# Altium project SSB-Demod.PrjPcb
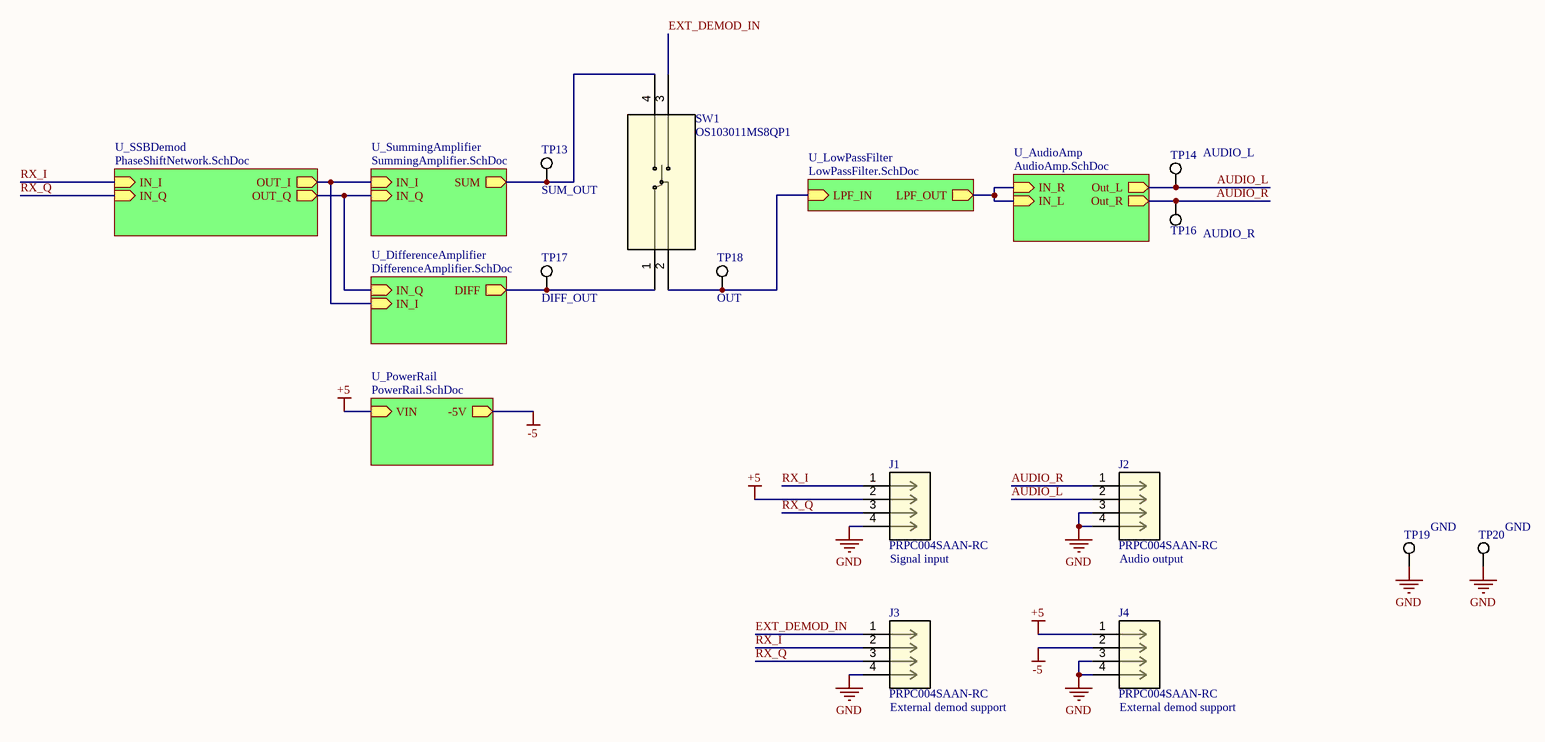
[diagram p0: TopLevel.SchDoc]
7 sheets, 135 parts. Net scope: hierarchical (ports join the sheet entries above them; power ports are global).
Board file: SSB-Demod.PcbDoc
Sheets:
  TopLevel.SchDoc
    U_SSBDemod = PhaseShiftNetwork.SchDoc
    U_AudioAmp = AudioAmp.SchDoc
    U_PowerRail = PowerRail.SchDoc
    U_SummingAmplifier = SummingAmplifier.SchDoc
    U_DifferenceAmplifier = DifferenceAmplifier.SchDoc
    U_LowPassFilter = LowPassFilter.SchDoc

## Sheet TopLevel.SchDoc
size 420 x 297 mm; SheetNumber: 1; SheetTotal: 7

### Parts
J1  PRPC004SAAN-RC  [CONN4_PRPC004_SUL]
J2  PRPC004SAAN-RC  [CONN4_PRPC004_SUL]
J3  PRPC004SAAN-RC  [CONN4_PRPC004_SUL]
J4  PRPC004SAAN-RC  [CONN4_PRPC004_SUL]
SW1  OS103011MS8QP1  [DIP4_SP3T-TOP_4P3X8P6_CNK]
TP13  SUM_OUT  [KSTN-5019_V]
TP14  AUDIO_L  [KSTN-5019_V]
TP16  AUDIO_R  [KSTN-5019_V]
TP17  DIFF_OUT  [KSTN-5019_V]
TP18  OUT  [KSTN-5019_V]
TP19  GND  [KSTN-5019_V]
TP20  GND  [KSTN-5019_V]

### Sub-sheets
U_AudioAmp = AudioAmp.SchDoc: IN_R (in), IN_L (in), Out_L (out), Out_R (out)
U_DifferenceAmplifier = DifferenceAmplifier.SchDoc: DIFF (out), IN_Q (in), IN_I (in)
U_LowPassFilter = LowPassFilter.SchDoc: LPF_IN (in), LPF_OUT (out)
U_PowerRail = PowerRail.SchDoc: -5V (out), VIN (in)
U_SSBDemod = PhaseShiftNetwork.SchDoc: IN_I (in), IN_Q (in), OUT_I (out), OUT_Q (out)
U_SummingAmplifier = SummingAmplifier.SchDoc: IN_I (in), IN_Q (in), SUM (out)

### Nets
+5: J1.2 J4.1 ; sheet U_PowerRail/VIN
-5: J4.2 ; sheet U_PowerRail/-5V
GND: J1.4 J2.3 J2.4 J3.4 J4.3 J4.4 TP19.1 TP20.1
AUDIO_L: J2.2 TP14.1 ; sheet U_AudioAmp/Out_L
AUDIO_R: J2.1 TP16.1 ; sheet U_AudioAmp/Out_R
EXT_DEMOD_IN: J3.1 SW1.3
RX_I: J1.1 J3.2 ; sheet U_SSBDemod/IN_I
RX_Q: J1.3 J3.3 ; sheet U_SSBDemod/IN_Q
NetC14_1: sheet U_AudioAmp/IN_R, sheet U_AudioAmp/IN_L, sheet U_LowPassFilter/LPF_OUT
NetR12_2: sheet U_SSBDemod/OUT_I, sheet U_SummingAmplifier/IN_I, sheet U_DifferenceAmplifier/IN_I
NetR30_2: sheet U_SSBDemod/OUT_Q, sheet U_SummingAmplifier/IN_Q, sheet U_DifferenceAmplifier/IN_Q
NetR44_2: SW1.4 TP13.1 ; sheet U_SummingAmplifier/SUM
NetR48_2: SW1.1 TP17.1 ; sheet U_DifferenceAmplifier/DIFF
NetSW1_2: SW1.2 TP18.1 ; sheet U_LowPassFilter/LPF_IN

### Notes on the sheet
- (near J1) Signal input
- (near J2) Audio output
- (near J3) External demod support
- (near J4) External demod support
- THIS DOCUMENT AND THE DATA DISCLOSED HEREIN OR
- HEREWITH IS THE PROPERTY OF ALTIUM LIMITED AND MAY
- DWG NO:
- REVISION
- REV:
- DESCRIPTION
- DATE
- APPROVED
- BE FREELY DISTRIBUTED IN WHOLE. NO RIGHTS ARE
- RESERVED OR EXPRESS OR IMPLIED WARANTEE GIVEN.
- ENG:
- APPROVALS
- PROJECT
- DSN:
- CHK:
- REFERENCE DOCUMENTS
- PROJECT REVISION:
- TITLE
- DOCUMENT REVISION:
- DESIGN ITEM:
- BOM:
- FAB DWG:
- PCB DWG:
- ASSY DWG:
- SCALE:
- A3
- SIZE
- CAGE CODE
- FILE NAME
- DWG NO.
- SHEET
- OF
- REV

### Library data of the parts
J1-J4 = PRPC004SAAN-RC: No Description Available; Mfr_Name: Sullins; Type: Headers, Male Pins; RefDes: RefDes
SW1 = OS103011MS8QP1: No Description Available; Mfr_Name: C&K Components; Type: Slide Switches; RefDes: RefDes
TP13 TP14 TP16-TP20 = CMP-1672-00008-1: Test Point, 1 Position SMD, RoHS, Tape and Reel; ComponentLink1Description: Manufacturer URL; Package Quantity: 1000; DatasheetVersion: 03/2014; Packaging: Tape and Reel; ComponentLink2URL: http://www.keyelco.com/product-pdf.cfm?p=1357; ComponentLink1URL: http://www.keyelco.com/; Mount: Surface Mount; Contact Plating: Silver; PackageDescription: 1-Pin Surface Mount Device, Body 3.81 x 2.03 mm; Pins: 1; RoHSCompliant: True; Mounting Technology: Surface Mount; ComponentLink2Description: Datasheet; PackageReference: 5019

## Sheet PhaseShiftNetwork.SchDoc: Phase Shifter
size 594 x 420 mm; SheetNumber: 4; SheetTotal: 7
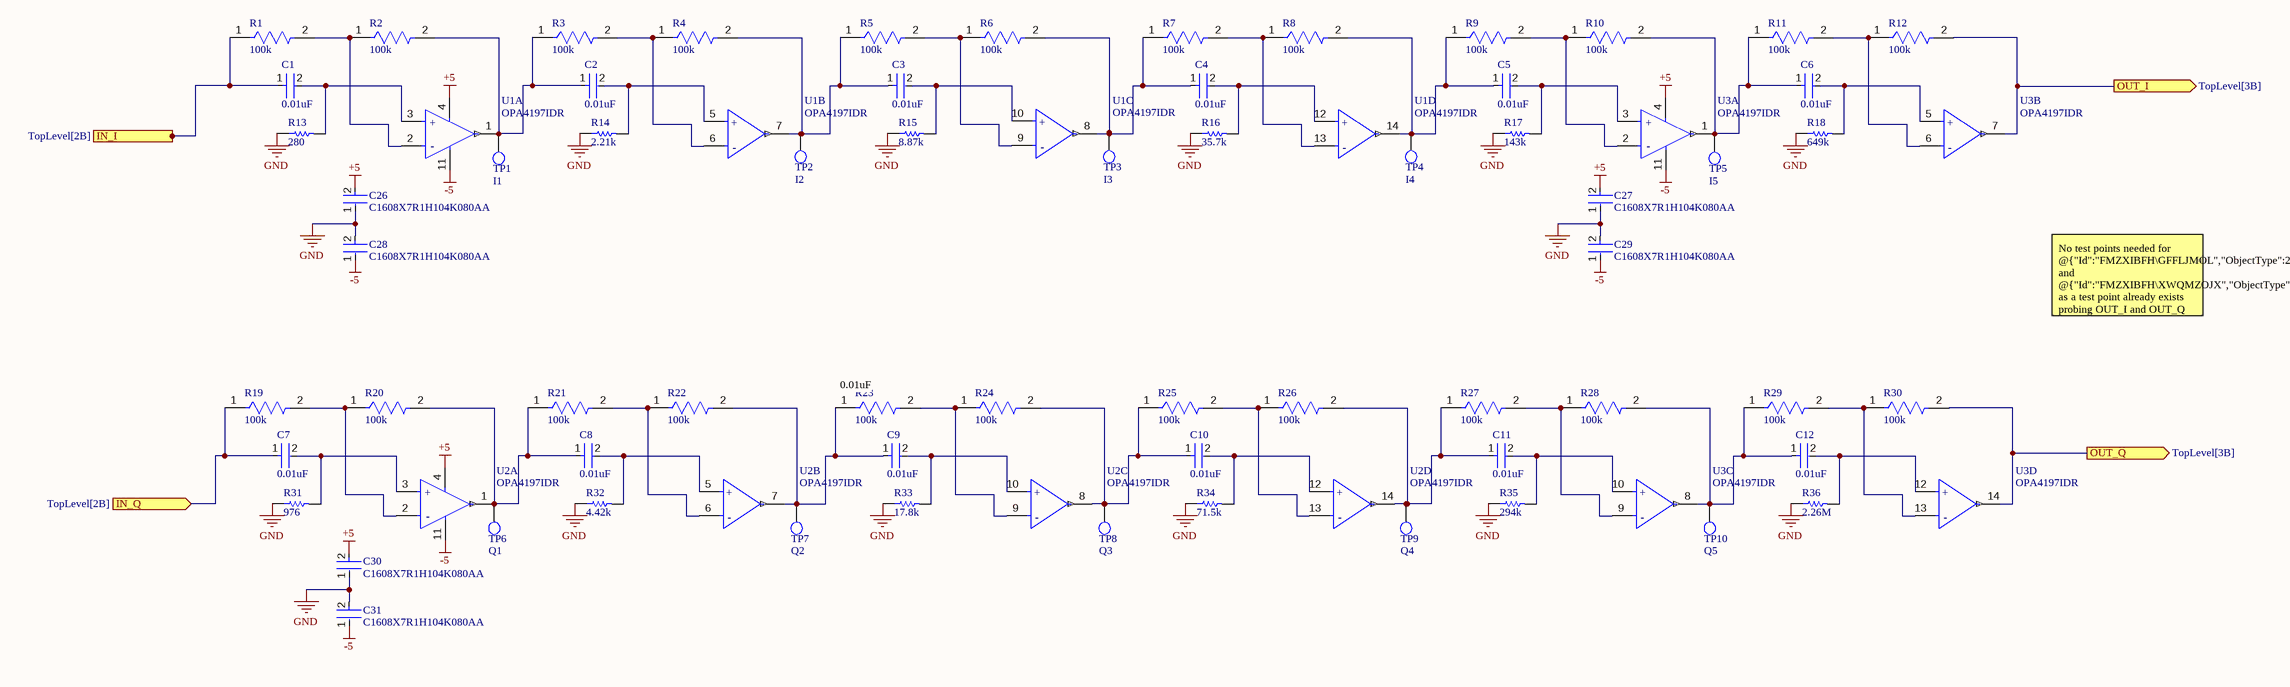
[diagram p1: PhaseShiftNetwork.SchDoc]

### Parts
C1  0.01uF  [FP-C0603C-CF-MFG]
C2  0.01uF  [FP-C0603C-CF-MFG]
C3  0.01uF  [FP-C0603C-CF-MFG]
C4  0.01uF  [FP-C0603C-CF-MFG]
C5  0.01uF  [FP-C0603C-CF-MFG]
C6  0.01uF  [FP-C0603C-CF-MFG]
C7  0.01uF  [FP-C0603C-CF-MFG]
C8  0.01uF  [FP-C0603C-CF-MFG]
C9  0.01uF  [FP-C0603C-CF-MFG]
C10  0.01uF  [FP-C0603C-CF-MFG]
C11  0.01uF  [FP-C0603C-CF-MFG]
C12  0.01uF  [FP-C0603C-CF-MFG]
C26  C1608X7R1H104K080AA  [FP-C1608-080-0_1-MFG]
C27  C1608X7R1H104K080AA  [FP-C1608-080-0_1-MFG]
C28  C1608X7R1H104K080AA  [FP-C1608-080-0_1-MFG]
C29  C1608X7R1H104K080AA  [FP-C1608-080-0_1-MFG]
C30  C1608X7R1H104K080AA  [FP-C1608-080-0_1-MFG]
C31  C1608X7R1H104K080AA  [FP-C1608-080-0_1-MFG]
R1  100k  [FP-RC0805-0_6-IPC_C]
R2  100k  [FP-RC0805-0_6-IPC_C]
R3  100k  [FP-RC0805-0_6-IPC_C]
R4  100k  [FP-RC0805-0_6-IPC_C]
R5  100k  [FP-RC0805-0_6-IPC_C]
R6  100k  [FP-RC0805-0_6-IPC_C]
R7  100k  [FP-RC0805-0_6-IPC_C]
R8  100k  [FP-RC0805-0_6-IPC_C]
R9  100k  [FP-RC0805-0_6-IPC_C]
R10  100k  [FP-RC0805-0_6-IPC_C]
R11  100k  [FP-RC0805-0_6-IPC_C]
R12  100k  [FP-RC0805-0_6-IPC_C]
R13  280  [RESC2013X60X35ML10T20]
R14  2.21k  [RESC2013X60X35ML10T20]
R15  8.87k  [RESC2013X60X35ML10T20]
R16  35.7k  [RESC2013X60X35ML10T20]
R17  143k  [RESC2013X60X35ML10T20]
R18  649k  [RESC2013X60X35ML10T20]
R19  100k  [FP-RC0805-0_6-IPC_C]
R20  100k  [FP-RC0805-0_6-IPC_C]
R21  100k  [FP-RC0805-0_6-IPC_C]
R22  100k  [FP-RC0805-0_6-IPC_C]
R23  100k  [FP-RC0805-0_6-IPC_C]
R24  100k  [FP-RC0805-0_6-IPC_C]
R25  100k  [FP-RC0805-0_6-IPC_C]
R26  100k  [FP-RC0805-0_6-IPC_C]
R27  100k  [FP-RC0805-0_6-IPC_C]
R28  100k  [FP-RC0805-0_6-IPC_C]
R29  100k  [FP-RC0805-0_6-IPC_C]
R30  100k  [FP-RC0805-0_6-IPC_C]
R31  976  [RESC2013X60X35ML10T20]
R32  4.42k  [RESC2013X60X35ML10T20]
R33  17.8k  [RESC2013X60X35ML10T20]
R34  71.5k  [RESC2013X60X35ML10T20]
R35  294k  [RESC2013X60X35ML10T20]
R36  2.26M  [RESC2013X60X35ML10T20]
TP1  I1  [TP-PAD]
TP2  I2  [TP-PAD]
TP3  I3  [TP-PAD]
TP4  I4  [TP-PAD]
TP5  I5  [TP-PAD]
TP6  Q1  [TP-PAD]
TP7  Q2  [TP-PAD]
TP8  Q3  [TP-PAD]
TP9  Q4  [TP-PAD]
TP10  Q5  [TP-PAD]
U1  OPA4197IDR  [FP-D0014A-MFG]  (parts A,B,C,D of 4)
U2  OPA4197IDR  [FP-D0014A-MFG]  (parts A,B,C,D of 4)
U3  OPA4197IDR  [FP-D0014A-MFG]  (parts A,B,C,D of 4)

### Ports
IN_I (in, see TopLevel[2B]), IN_Q (in, see TopLevel[2B]), OUT_I (out, see TopLevel[3B]), OUT_Q (out, see TopLevel[3B])

### Nets
+5: C26.2 C27.2 C30.2 U1.4(V+) U2.4(V+) U3.4(V+)
-5: C28.1 C29.1 C31.1 U1.11(V-) U2.11(V-) U3.11(V-)
GND: C26.1 C27.1 C28.2 C29.2 C30.1 C31.2 R13.1 R14.1 R15.1 R16.1 R17.1 R18.1 R31.1 R32.1 R33.1 R34.1 R35.1 R36.1
RX_I: C1.1 R1.1 ; port IN_I
RX_Q: C7.1 R19.1 ; port IN_Q
NetC1_2: C1.2 R13.2 U1.3(+IN_A)
NetC2_1: C2.1 R2.2 R3.1 TP1.1 U1.1(OUT_A)
NetC2_2: C2.2 R14.2 U1.5(+IN_B)
NetC3_1: C3.1 R4.2 R5.1 TP2.1 U1.7(OUT_B)
NetC3_2: C3.2 R15.2 U1.10(+IN_C)
NetC4_1: C4.1 R6.2 R7.1 TP3.1 U1.8(OUT_C)
NetC4_2: C4.2 R16.2 U1.12(+IN_D)
NetC5_1: C5.1 R8.2 R9.1 TP4.1 U1.14(OUT_D)
NetC5_2: C5.2 R17.2 U3.3(+IN_A)
NetC6_1: C6.1 R10.2 R11.1 TP5.1 U3.1(OUT_A)
NetC6_2: C6.2 R18.2 U3.5(+IN_B)
NetC7_2: C7.2 R31.2 U2.3(+IN_A)
NetC8_1: C8.1 R20.2 R21.1 TP6.1 U2.1(OUT_A)
NetC8_2: C8.2 R32.2 U2.5(+IN_B)
NetC9_1: C9.1 R22.2 R23.1 TP7.1 U2.7(OUT_B)
NetC9_2: C9.2 R33.2 U2.10(+IN_C)
NetC10_1: C10.1 R24.2 R25.1 TP8.1 U2.8(OUT_C)
NetC10_2: C10.2 R34.2 U2.12(+IN_D)
NetC11_1: C11.1 R26.2 R27.1 TP9.1 U2.14(OUT_D)
NetC11_2: C11.2 R35.2 U3.10(+IN_C)
NetC12_1: C12.1 R28.2 R29.1 TP10.1 U3.8(OUT_C)
NetC12_2: C12.2 R36.2 U3.12(+IN_D)
NetR1_2: R1.2 R2.1 U1.2(-IN_A)
NetR3_2: R3.2 R4.1 U1.6(-IN_B)
NetR5_2: R5.2 R6.1 U1.9(-IN_C)
NetR7_2: R7.2 R8.1 U1.13(-IN_D)
NetR9_2: R9.2 R10.1 U3.2(-IN_A)
NetR11_2: R11.2 R12.1 U3.6(-IN_B)
NetR12_2: R12.2 U3.7(OUT_B) ; port OUT_I
NetR19_2: R19.2 R20.1 U2.2(-IN_A)
NetR21_2: R21.2 R22.1 U2.6(-IN_B)
NetR23_2: R23.2 R24.1 U2.9(-IN_C)
NetR25_2: R25.2 R26.1 U2.13(-IN_D)
NetR27_2: R27.2 R28.1 U3.9(-IN_C)
NetR29_2: R29.2 R30.1 U3.13(-IN_D)
NetR30_2: R30.2 U3.14(OUT_D) ; port OUT_Q

### Notes on the sheet
- No test points needed for @{"Id":"FMZXIBFH\GFFLJMOL","ObjectType":2} and @{"Id":"FMZXIBFH\XWQMZOJX","ObjectType":2} as a test point already exists probing OUT_I and OUT_Q on the top level.
- (near R23) 0.01uF
- DWG NO:
- REV:
- THIS DOCUMENT AND THE DATA DISCLOSED HEREIN OR
- HEREWITH IS THE PROPERTY OF ALTIUM LIMITED AND MAY
- BE FREELY DISTRIBUTED IN WHOLE. NO RIGHTS ARE
- RESERVED OR EXPRESS OR IMPLIED WARANTEE GIVEN.
- REVISION
- DESCRIPTION
- DATE
- APPROVED
- ENG:
- APPROVALS
- PROJECT
- DSN:
- CHK:
- REFERENCE DOCUMENTS
- PROJECT REVISION:
- TITLE
- DOCUMENT REVISION:
- DESIGN ITEM:
- BOM:
- FAB DWG:
- PCB DWG:
- ASSY DWG:
- SCALE:
- A2
- SIZE
- CAGE CODE
- FILE NAME
- DWG NO.
- SHEET
- OF
- REV
- (in symbol CMP-04895-000272-1, part A) +; -
- (in symbol CMP-04895-000272-1, part B) +; -
- (in symbol CMP-04895-000272-1, part C) +; -
- (in symbol CMP-04895-000272-1, part D) +; -

### Library data of the parts
C1-C12 = CMP-2006-03370-2: CAP CER 10000PF 25V 1% NP0 0603; Manufacturer: KEMET; Manufacturer Part Number: C0603C103F3GACTU; Automotive Grade: Grade 1; Capacitance: 10,000 pF; Temperature Coefficient: 30ppm/°C; Material: Ceramic; Value: 10,000 pF; Temperature Characteristic: C0G; Tolerance: 0.01; Temperature Range High: +125°C; Category: Cap; Mouser Description: Multilayer Ceramic Capacitors MLCC - SMD/SMT 25volts 10000pF 1% C0G; Automotive: Yes; Octopart: https://octopart.com/c0603c103f3gactu-kemet-12577573; ComponentLink2Description: Datasheet; Temperature Range Low: -55°C; Package: C0603C-CF; RoHS: TRUE; Temperature: -55°C to +125°C; Device Class L1: Passive Components; ComponentLink2URL: https://api.kemet.com/component-edge/download/datasheet/C0603C100J5GACAUTO.pdf; Voltage Rating: 25 V; Digikey Description: CAP CER 10000PF 25V 1% NP0 0603; Device Class L2: Capacitors; Device Class L3: Ceramic Capacitors; Height: 0.87mm; Lead Free: Yes
C26-C31 = CMP-2000-04982-2: Multilayer Ceramic Capacitors 100nF ±10% 50V X7R SMD 0603; REACH SVHC: No SVHC; Voltage: 50V; Min Operating Temperature: -55°C; Package Quantity: 1; Case Code (Metric): 1608; Series: C; Termination: SMD/SMT; Length: 1.6mm; Voltage Rating: 50V; Case Code (Imperial): 0603; Number of Pins: 2; RoHS Compliant: Yes; Thickness: 0.037inch; Resistor Type: Ceramic; Radiation Hardening: No; Weight: 7.1E-05oz; Mount: Surface Mount; Capacitance: 100nF; Voltage Rating (DC): 50V; Construction: Flat; Tolerance: 10%; Lead Free: Lead Free; Case/Package: 0603; Max Operating Temperature: 125°C; Height: 0.8mm; Depth: 0.8mm; Packaging: Tape and Reel; Width: 0.031inch; Dielectric Material: Ceramic; Dielectric: X7R
R1-R12 R19-R30 = CMP-2100-03668-5: RES 100K OHM 1% 1/8W 0805; Power Rating: 125mW; Temperature Coefficient: 100ppm/°C; Voltage Rating (DC): 150V; Resistance: 100kR; Package Quantity: 1; Case/Package: 0805; Lead Pitch: 0.4mm; Case Code (Imperial): 0805; Construction: Rectangular; Number of Terminations: 2; RoHS Compliant: Yes; Max Power Dissipation: 125mW; Tolerance: 1%; Max Operating Temperature: 155°C; Resistance Tolerance: 1%; Lead Free: Lead Free; Packaging: Tape and Reel; Resistor Type: Thick Film; Min Operating Temperature: -55°C; Case Code (Metric): 2012; Series: RC; Technology: THICK FILM; Voltage Rating: 150V; Termination: SMD/SMT; Width: 0.049inch; Number of Pins: 2; Features: Moisture Resistant; Military Standard: Not; Length: 0.079inch; Depth: 1.25mm; Size Code: 0805; Height: 0.024inch
R13 R15-R18 R31-R36 = CMP-2001-01038-1: Manufacturer: Yageo; Part Number: RC0805FR-07280RL
R14 = CMP-2001-01038-1: Manufacturer: Yageo; Part Number: RC0805FR-072K21L
TP1-TP10 = TP-PAD
U1-U3 = CMP-04895-000272-1: IC OPAMP GP 4 CIRCUIT 14SOIC; Number of Channels: 4; Gain Bandwidth Product: 10MHz; Max Operating Temperature: 125°C; Min Operating Temperature: -40°C; Lead Free: Lead Free; RoHS Compliant: Yes; Case/Package: SOIC

## Sheet AudioAmp.SchDoc
size A; SheetNumber: 2; SheetTotal: 7
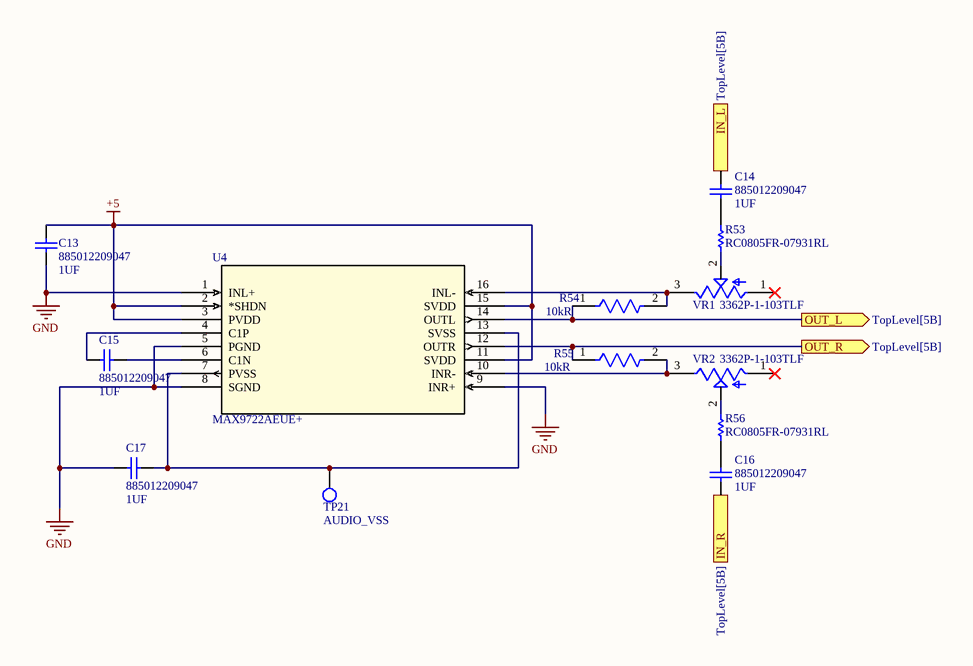
[diagram p2: AudioAmp.SchDoc]

### Parts
C13  885012209047  value 1UF  [1210]
C14  885012209047  value 1UF  [1210]
C15  885012209047  value 1UF  [1210]
C16  885012209047  value 1UF  [1210]
C17  885012209047  value 1UF  [1210]
R53  RC0805FR-07931RL  [RESC2013X60X35ML10T20]
R54  Resistance: 10kR  [FP-RC0603-0_55-IPC_C]  (hidden comment: RC0603FR-0710KL)
R55  Resistance: 10kR  [FP-RC0603-0_55-IPC_C]  (hidden comment: RC0603FR-0710KL)
R56  RC0805FR-07931RL  [RESC2013X60X35ML10T20]
TP21  AUDIO_VSS  [TP-PAD]
U4  MAX9722AEUE+  [21-0066J_16]
VR1  3362P-1-103TLF  [TRIM_3362P-1-103TLF]
VR2  3362P-1-103TLF  [TRIM_3362P-1-103TLF]

### Ports
IN_L (in, see TopLevel[5B]), IN_R (in, see TopLevel[5B]), OUT_L (out, see TopLevel[5B]), OUT_R (out, see TopLevel[5B])

### Nets
+5: C13.1 U4.2(*SHDN) U4.3(PVDD) U4.11(SVDD) U4.15(SVDD)
GND: C13.2 C17.2 U4.1(INL+) U4.5(PGND) U4.8(SGND) U4.9(INR+)
AUDIO_L: R54.1 U4.14(OUTL) ; port OUT_L
AUDIO_R: R55.1 U4.12(OUTR) ; port OUT_R
NetC14_1: C14.1 C16.1 ; port IN_R, port IN_L
NetC14_2: C14.2 R53.2
NetC15_1: C15.1 U4.6(C1N)
NetC15_2: C15.2 U4.4(C1P)
NetC16_2: C16.2 R56.1
NetC17_1: C17.1 TP21.1 U4.7(PVSS) U4.13(SVSS)
NetR53_1: R53.1 VR1.2(WIPER)
NetR54_2: R54.2 U4.16(INL-) VR1.3(CW)
NetR55_2: R55.2 U4.10(INR-) VR2.3(CW)
NetR56_2: R56.2 VR2.2(WIPER)

Not connected (* = marked no-connect by the designer): VR1 1(CCW)*; VR2 1(CCW)*

### Library data of the parts
C13-C17 = CAP CER 1UF 50V X7R 1210: Capacitor; Designator: C?; Voltage Rating: 50V; Published: 8-Jun-2000; LatestRevisionDate: 17-Jul-2002; LatestRevisionNote: Re-released for DXP Platform.; Publisher: Altium Limited; Manufacturer Part Number: 885012209047
R53 R56 = CMP-2001-01307-1: Manufacturer: Yageo; Part Number: RC0805FR-07931RL
R54 R55 = CMP-2100-03664-2: RES 10K OHM 1% 1/10W 0603; Voltage Rating: 75V; Voltage Rating (DC): 50V; Power Rating: 100mW; Temperature Coefficient: 100ppm/°C; Depth: 0.8mm; Termination: SMD/SMT; Resistor Type: Thick Film; Series: RC; Construction: Rectangular; Features: Moisture Resistant; Packaging: Tape and Reel; Min Operating Temperature: -55°C; Number of Terminations: 2; Lead Pitch: 0.3mm; RoHS Compliant: Yes; Case/Package: 0603; Resistance Tolerance: 1%; Military Standard: Not; Weight: 7.1E-05oz; Number of Pins: 2; Tolerance: 1%; Length: 1.6mm; Case Code (Imperial): 0603; Lead Free: Lead Free; Width: 0.8mm; Max Power Dissipation: 100mW; Height: 0.45mm; Max Operating Temperature: 155°C; Case Code (Metric): 1608; Size Code: 0603
TP21 = TP-PAD
U4 = MAX9722AEUE+: No Description Available; Mfr_Name: Analog Devices Inc; RefDes: RefDes; Type: Type
VR1 VR2 = 3362P-1-103TLF: 10 kOhms 0.5W, 1/2W PC Pins Through Hole Trimmer Potentiometer Cermet 1 Turn Top Finger Adjustment; MF: Bourns; SnapEDA_Link: https://www.snapeda.com/parts/3362P-1-103TLF/Bourns/view-part/282422/?ref=snap; MP: 3362P-1-103TLF; Package: 3362P-1-T Bourns Inc.; Check_prices: https://www.snapeda.com/parts/3362P-1-103TLF/Bourns/view-part/282422/?ref=eda; Value: *; Purchase-URL: https://pricing.snapeda.com/search/part/3362P-1-103TLF/?ref=eda; Digi-Key_Part_Number: 3362P-103TLF-ND

## Sheet PowerRail.SchDoc
size 420 x 297 mm; SheetNumber: 5; SheetTotal: 7
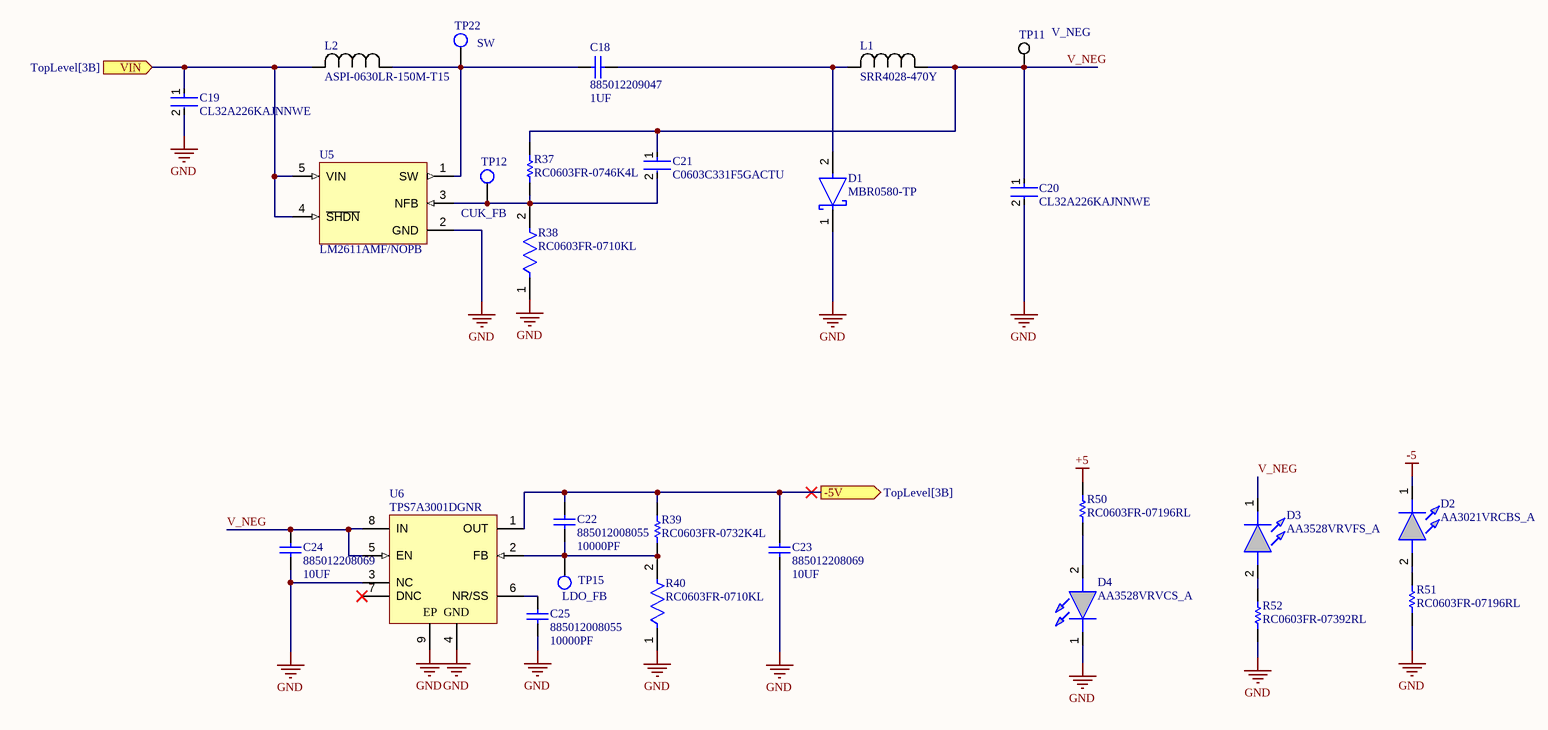
[diagram p3: PowerRail.SchDoc]

### Parts
C18  885012209047  value 1UF  [1210]
C19  CL32A226KAJNNWE  [FP-CL32-IPC_B]
C20  CL32A226KAJNNWE  [FP-CL32-IPC_B]
C21  C0603C331F5GACTU  [FP-C0603C-CF-MFG]
C22  885012008055  value 10000PF  [1206]
C23  885012208069  value 10UF  [1206]
C24  885012208069  value 10UF  [1206]
C25  885012008055  value 10000PF  [1206]
D1  MBR0580-TP  [FP-SOD-123-IPC_C]
D2  AA3021VRCBS_A  [LEDM3020X150N]
D3  AA3528VRVFS_A  [AA3528VRVFSA]
D4  AA3528VRVCS_A  [AA3528VRVFSA]
L1  SRR4028-470Y  [IND_BOURNS_SRR4028]
L2  ASPI-0630LR-150M-T15  [IND_ASPI-0630LR_ABR]
R37  RC0603FR-0746K4L  [RESC0603(1608)_N]
R38  RC0603FR-0710KL  [FP-RC0603-0_55-IPC_C]
R39  RC0603FR-0732K4L  [RESC1608X55X25ML10T15]
R40  RC0603FR-0710KL  [FP-RC0603-0_55-IPC_C]
R50  RC0603FR-07196RL  [RESC1608X55X25NL10T15]
R51  RC0603FR-07196RL  [RESC1608X55X25NL10T15]
R52  RC0603FR-07392RL  [RESC1608X55X25ML10T15]
TP11  V_NEG  [KSTN-5019_V]
TP12  CUK_FB  [TP-PAD]
TP15  LDO_FB  [TP-PAD]
TP22  SW  [TP-PAD]
U5  LM2611AMF/NOPB  [DBV0005A_N]
U6  TPS7A3001DGNR  [DGN0008D_L]

### Ports
-5V (out, see TopLevel[3B]), VIN (in, see TopLevel[3B])

### Nets
+5: C19.1 L2.2 R50.2 U5.4(~{SHDN}) U5.5(VIN) ; port VIN
-5: C22.2 C23.2 D2.1(K) R39.2 U6.1(OUT) ; port -5V
GND: C19.2 C20.2 C23.1 C24.1 C25.1 D1.1(C) D4.1(K) R38.1 R40.1 R51.1 R52.1 U5.2(GND) U6.3(NC) U6.4(GND) U6.9(EP)
V_NEG: C20.1 C21.1 C24.2 D3.1(K) L1.1 R37.2 TP11.1 U6.5(EN) U6.8(IN)
NetC18_1: C18.1 D1.2(A) L1.2
NetC18_2: C18.2 L2.1 TP22.1 U5.1(SW)
NetC21_2: C21.2 R37.1 R38.2 TP12.1 U5.3(NFB)
NetC22_1: C22.1 R39.1 R40.2 TP15.1 U6.2(FB)
NetC25_2: C25.2 U6.6(NR/SS)
NetD2_2: D2.2(A) R51.2
NetD3_2: D3.2(A) R52.2
NetD4_2: D4.2(A) R50.1

Not connected (* = marked no-connect by the designer): U6 7(DNC)*

### Notes on the sheet
- THIS DOCUMENT AND THE DATA DISCLOSED HEREIN OR
- HEREWITH IS THE PROPERTY OF ALTIUM LIMITED AND MAY
- DWG NO:
- REVISION
- REV:
- DESCRIPTION
- DATE
- APPROVED
- BE FREELY DISTRIBUTED IN WHOLE. NO RIGHTS ARE
- RESERVED OR EXPRESS OR IMPLIED WARANTEE GIVEN.
- ENG:
- APPROVALS
- PROJECT
- DSN:
- CHK:
- REFERENCE DOCUMENTS
- PROJECT REVISION:
- TITLE
- DOCUMENT REVISION:
- DESIGN ITEM:
- BOM:
- FAB DWG:
- PCB DWG:
- ASSY DWG:
- SCALE:
- A3
- SIZE
- CAGE CODE
- FILE NAME
- DWG NO.
- SHEET
- OF
- REV

### Library data of the parts
C18 = CAP CER 1UF 50V X7R 1210: as C13 on sheet AudioAmp; Published: 8-Jun-2000; LatestRevisionDate: 17-Jul-2002; LatestRevisionNote: Re-released for DXP Platform.; Publisher: Altium Limited; Manufacturer Part Number: 885012209047
C19 C20 = CMP-13271-000793-1: Cap Ceramic 22uF 25V X5R ±10% SMD 1210 +85°C Embossed T/R; Voltage Rating: 25V; Lead Free: Lead Free; Case Code (Imperial): 1210; Case Code (Metric): 3225; Capacitance: 22uF; Mount: Surface Mount; Max Operating Temperature: 85°C; Thickness: 0.106inch; Width: 0.098inch; Packaging: Cut Tape; Package Quantity: 1; Tolerance: 10%; Length: 0.126inch; Min Operating Temperature: -55°C; Case/Package: 1210
C21 = CMP-1035-01569-3: CAP CER 330PF 50V 1% NP0 0603; Manufacturer: KEMET; Temperature Coefficient: 30ppm/°C; Temperature Characteristic: C0G; Material: Ceramic; Tolerance: 0.01; Automotive Grade: Grade 1; Voltage Rating: 50 V; Temperature: -55°C to +125°C; Temperature Range High: +125°C; ComponentLink2Description: Datasheet; Automotive: Yes; Octopart: https://octopart.com/c0603c331f5gactu-kemet-9142706; Temperature Range Low: -55°C; Value: 330 pF; ComponentLink2URL: https://api.kemet.com/component-edge/download/datasheet/C0603C100J5GACAUTO.pdf; Device Class L1: Passive Components; Mouser Description: Multilayer Ceramic Capacitors MLCC - SMD/SMT 50volts 330pF C0G 1%; Capacitance: 330 pF; Device Class L3: Ceramic Capacitors; Manufacturer Part Number: C0603C331F5GACTU; Height: 0.87mm; RoHS: TRUE; Device Class L2: Capacitors; Package: C0603C-CF; Digikey Description: CAP CER 330PF 50V 1% NP0 0603; Category: Cap; Lead Free: Yes
C22 C25 = CAP CER 10000PF 50V C0G/NP0 1206: Capacitor; Designator: C?; Voltage Rating: 50V; Published: 8-Jun-2000; LatestRevisionDate: 17-Jul-2002; LatestRevisionNote: Re-released for DXP Platform.; Publisher: Altium Limited; Manufacturer Part Number: 885012008055
C23 C24 = CAP CER 10UF 25V X7R 1206: Capacitor; Designator: C?; Voltage Rating: 25V; Published: 8-Jun-2000; LatestRevisionDate: 17-Jul-2002; LatestRevisionNote: Re-released for DXP Platform.; Publisher: Altium Limited; Manufacturer Part Number: 885012208069
D1 = CMP-56206-000006-1: DIODE SCHOTTKY 80V 500MA SOD123; Max Power Dissipation: 410mW; Max Reverse Leakage Current: 200uA; Max Surge Current: 5.5A; Forward Voltage: 800mV; Min Operating Temperature: -55°C; Packaging: Tape and Reel; Max Operating Temperature: 150°C; Lead Free: Lead Free; Peak Reverse Current: 200uA; Mount: Surface Mount; Max Reverse Voltage (DC): 80V; Package Quantity: 1; Max Repetitive Reverse Voltage (Vrrm): 80V; Average Rectified Current: 500mA
D2 = AA3021VRCBS_A: 3.0x2.0mm Blue Lagoon SMD LED (X=0.19, Y=0.37); Manufacturer_Name: Kingbright; Manufacturer_Part_Number: AA3021VRCBS/A; Geometry.Height: 1.5mm; Mouser Part Number: 604-AA3021VRCBSA; Mouser Price/Stock: https://www.mouser.co.uk/ProductDetail/Kingbright/AA3021VRCBS-A?qs=xhbEVWpZdWfh%2FUbhtEnz2w%3D%3D; Arrow Part Number: AA3021VRCBS/A; Arrow Price/Stock: https://www.arrow.com/en/products/aa3021vrcbsa/kingbright; Datasheet Link: https://www.arrow.com/en/products/aa3021vrcbsa/kingbright
D3 = AA3528VRVFS_A: LED Uni-Color Violet 2-Pin SMD T/R; Manufacturer_Name: Kingbright; Manufacturer_Part_Number: AA3528VRVFS/A; Geometry.Height: 2.1mm; Mouser Part Number: 604-AA3528VRVFS/A; Mouser Price/Stock: https://www.mouser.co.uk/ProductDetail/Kingbright/AA3528VRVFS-A?qs=rY7msk5yxfb63mh907EyRA%3D%3D; Arrow Part Number: AA3528VRVFS/A; Arrow Price/Stock: https://www.arrow.com/en/products/aa3528vrvfsa/kingbright?region=nac; Datasheet Link: https://mouser.componentsearchengine.com/Datasheets/1/AA3528VRVFS_A.pdf
D4 = AA3528VRVCSA: LED Uni-Color Pink 2-Pin SMD T/R; Manufacturer_Name: Kingbright; Manufacturer_Part_Number: AA3528VRVCS/A; Geometry.Height: 2.1mm; Mouser Part Number: 604-AA3528VRVFS/A; Mouser Price/Stock: https://www.mouser.co.uk/ProductDetail/Kingbright/AA3528VRVFS-A?qs=rY7msk5yxfb63mh907EyRA%3D%3D; Arrow Part Number: AA3528VRVCS/A; Arrow Price/Stock: https://www.arrow.com/en/products/aa3528vrvfsa/kingbright?region=nac; Datasheet Link: https://mouser.componentsearchengine.com/Datasheets/1/AA3528VRVFS_A.pdf
L1 = SRR4028-470Y: No Description Available; Mfr_Name: Bourns Electronics
L2 = ASPI-0630LR-150M-T15: No Description Available; Mfr_Name: Abracon; Type: Fixed Inductors
R37 = CMP-1012-00698-1: 46K4 0.1W 1% 0603 (1608 Metric)  SMD / RC0603FR-0746K4L Yageo; Case-Metric: 1608; Case-EIA: 0603; Value: 46400.00 Ohm; Technology: SMT; Tolerance: 1 %; Power: 0.1 W
R38 R40 = CMP-2100-03664-2: RES 10K OHM 1% 1/10W 0603; Voltage Rating: 75V; Voltage Rating (DC): 50V; Resistance: 10kR; Power Rating: 100mW; Temperature Coefficient: 100ppm/°C; Depth: 0.8mm; Termination: SMD/SMT; Resistor Type: Thick Film; Series: RC; Construction: Rectangular; Features: Moisture Resistant; Packaging: Tape and Reel; Min Operating Temperature: -55°C; Number of Terminations: 2; Lead Pitch: 0.3mm; RoHS Compliant: Yes; Case/Package: 0603; Resistance Tolerance: 1%; Military Standard: Not; Weight: 7.1E-05oz; Number of Pins: 2; Tolerance: 1%; Length: 1.6mm; Case Code (Imperial): 0603; Lead Free: Lead Free; Width: 0.8mm; Max Power Dissipation: 100mW; Height: 0.45mm; Max Operating Temperature: 155°C; Case Code (Metric): 1608; Size Code: 0603
R39 = CMP-2000-04011-1: Manufacturer: Yageo; Part Number: RC0603FR-0732K4L
R50 R51 = CMP-2000-03929-1: Manufacturer: Yageo; Part Number: RC0603FR-07196RL
R52 = CMP-1012-00464-2: Manufacturer: Yageo; Part Number: RC0603FR-07392RL
TP11 = CMP-1672-00008-1: as TP13 on sheet TopLevel; ComponentLink1Description: Manufacturer URL; Package Quantity: 1000; DatasheetVersion: 03/2014; Packaging: Tape and Reel; ComponentLink2URL: http://www.keyelco.com/product-pdf.cfm?p=1357; ComponentLink1URL: http://www.keyelco.com/; Mount: Surface Mount; Contact Plating: Silver; PackageDescription: 1-Pin Surface Mount Device, Body 3.81 x 2.03 mm; Pins: 1; RoHSCompliant: True; Mounting Technology: Surface Mount; ComponentLink2Description: Datasheet; PackageReference: 5019
TP12 TP15 TP22 = TP-PAD
U5 = CMP-0069-01160-3: 1.4MHz Cuk Converter, 5-pin SOT-23, Pb-Free; Manufacturer: Texas Instruments; PowerWise: N; CompType: Switcher; PackageTopMarking: S40A*XTT; ComponentLink1URL: http://www.ti.com/general/docs/lit/getliterature.tsp?genericPartNumber=LM2611&fileType=pdf; PackageDescription: Molded SOT-23, .115 x .063 x .040 in Body, 5 Lead, .0375 in Pitch; ComponentLink1Description: Datasheet URL; PackageReference: DBV0005A; PinCount: 5; RoHS: Y
U6 = CMP-0394-01243-2: Single Output High PSRR LDO, 200 mA, Adjustable -1.18 to -33 V Output, -3 to -36 V Input, with Ultra-Low Noise, 8-pin MSOP (DGN), -40 to 125 degC, Green (RoHS & no Sb/Br); Manufacturer: Texas Instruments; Vdo(Typ)(mV): 216; Iq(Typ)(mA): 0.05; Iout(Max)(A): 0.2; SubFamily: Single Channel LDO; Accuracy(%): 1.5; PartNumber: TPS7A3001DGNR; PackageVersion: 4073271/F; Vin(Max)(V): -36; PackageDescription: 8-pin Plastic Small Outline, Body 3 x 3 mm, Pitch 0.65 mm; Code_JEDEC: MO-187; Vout Adj(Min)(V): -1.18; Mounting Technology: Surface Mount; ComponentLink1URL: http://www.ti.com/; ComponentLink3Description: Package Specification; Eco-Plan: Green (RoHS & no Sb/Br); PackageReference: DGN0008D; ComponentLink3URL: http://www.ti.com/litv/pdf/mpds046e; Vout Adj(Max)(V): -33; Vin(Min)(V): -3; ComponentLink1Description: Manufacturer URL; ComponentLink2URL: http://www.ti.com/general/docs/lit/getliterature.tsp?genericPartNumber=TPS7A3001&fileType=pdf; ComponentLink2Description: Datasheet; DatasheetVersion: SBVS125A

## Sheet SummingAmplifier.SchDoc: Summing Amplifier
size A; SheetNumber: 6; SheetTotal: 7
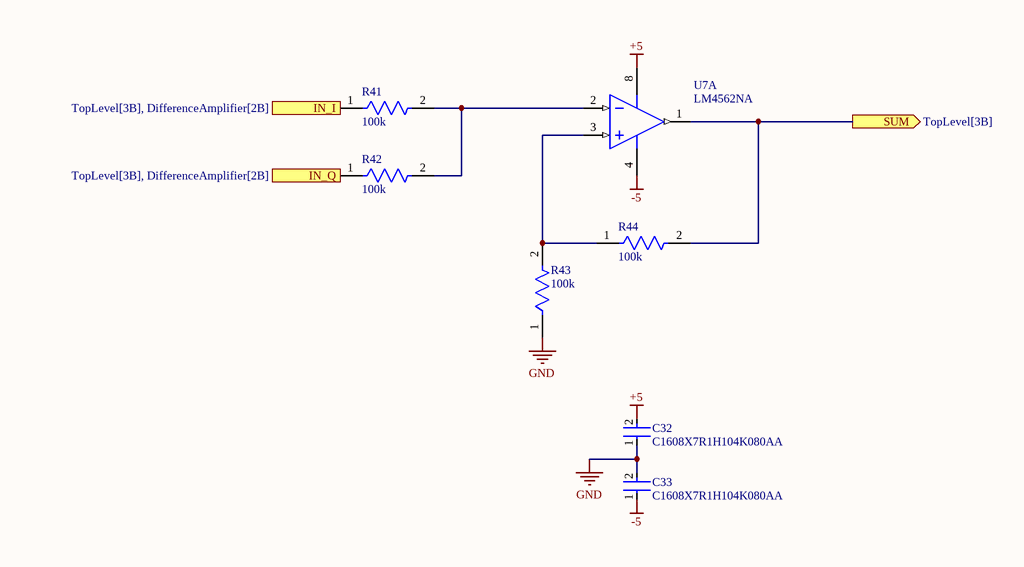
[diagram p4: SummingAmplifier.SchDoc]

### Parts
C32  C1608X7R1H104K080AA  [FP-C1608-080-0_1-MFG]
C33  C1608X7R1H104K080AA  [FP-C1608-080-0_1-MFG]
R41  100k  [FP-RC0805-0_6-IPC_C]
R42  100k  [FP-RC0805-0_6-IPC_C]
R43  100k  [FP-RC0805-0_6-IPC_C]
R44  100k  [FP-RC0805-0_6-IPC_C]
U7  LM4562NA  [N08E]  (part A of 2)

### Ports
IN_I (in, see TopLevel[3B], DifferenceAmplifier[2B]), IN_Q (in, see TopLevel[3B], DifferenceAmplifier[2B]), SUM (out, see TopLevel[3B])

### Nets
+5: C32.2 U7.8(V+)
-5: C33.1 U7.4(V-)
GND: C32.1 C33.2 R43.1
NetR12_2: R41.1 ; port IN_I
NetR30_2: R42.1 ; port IN_Q
NetR41_2: R41.2 R42.2 U7.2(IN_A)
NetR43_2: R43.2 R44.1 U7.3(IN_A)
NetR44_2: R44.2 U7.1(OUT_A) ; port SUM

### Library data of the parts
C32 C33 = CMP-2000-04982-2: as C26 on sheet PhaseShiftNetwork; REACH SVHC: No SVHC; Voltage: 50V; Min Operating Temperature: -55°C; Package Quantity: 1; Case Code (Metric): 1608; Series: C; Termination: SMD/SMT; Length: 1.6mm; Voltage Rating: 50V; Case Code (Imperial): 0603; Number of Pins: 2; RoHS Compliant: Yes; Thickness: 0.037inch; Resistor Type: Ceramic; Radiation Hardening: No; Weight: 7.1E-05oz; Mount: Surface Mount; Capacitance: 100nF; Voltage Rating (DC): 50V; Construction: Flat; Tolerance: 10%; Lead Free: Lead Free; Case/Package: 0603; Max Operating Temperature: 125°C; Height: 0.8mm; Depth: 0.8mm; Packaging: Tape and Reel; Width: 0.031inch; Dielectric Material: Ceramic; Dielectric: X7R
R41-R44 = CMP-2100-03668-5: as R1 on sheet PhaseShiftNetwork; Package Quantity: 1; Case/Package: 0805; Lead Pitch: 0.4mm; Case Code (Imperial): 0805; Construction: Rectangular; Number of Terminations: 2; RoHS Compliant: Yes; Max Power Dissipation: 125mW; Tolerance: 1%; Max Operating Temperature: 155°C; Resistance Tolerance: 1%; Lead Free: Lead Free; Packaging: Tape and Reel; Resistor Type: Thick Film; Min Operating Temperature: -55°C; Case Code (Metric): 2012; Series: RC; Technology: THICK FILM; Voltage Rating: 150V; Termination: SMD/SMT; Width: 0.049inch; Number of Pins: 2; Features: Moisture Resistant; Military Standard: Not; Length: 0.079inch; Depth: 1.25mm; Size Code: 0805; Height: 0.024inch
U7 = CMP-0057-00043-2: Dual High Performance, High Fidelity Audio Operational Amplifier, 8-pin MDIP; Manufacturer: National Semiconductor; PowerWise: Y; PackageTopMarking: NSUZXYTT*LM*4562NA; CompType: Audio IC; ComponentLink2Description: LM4562 Web Page; PinCount: 8; RoHS: Y; PackageReference: N08E; DatasheetVersion: Jan-2010; RevisionNote: Component URLs added; PackageVersion: revG, May-2006; Code_JEDEC: MS-001-BA; ComponentLink3URL: http://www.national.com/packaging/folders/n08e.html; ComponentLink1Description: LM4562 Datasheet; PackageDescription: MDIP, .365 x .250 x .130in, 8 Lead, .100in Pitch; ComponentLink3Description: N08E Package Page; ComponentLink1URL: http://www.national.com/ds/LM/LM4562.pdf; ComponentLink2URL: http://www.national.com/pf/LM/LM4562.html

## Sheet DifferenceAmplifier.SchDoc: Difference Amplifier
size A; SheetNumber: 3; SheetTotal: 6
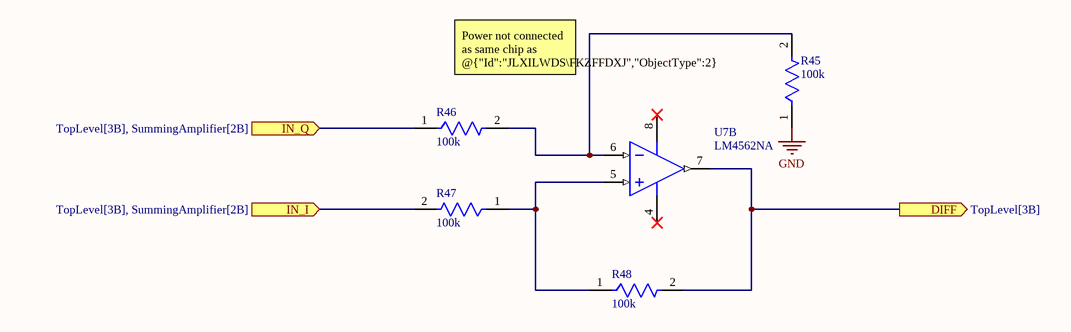
[diagram p5: DifferenceAmplifier.SchDoc]

### Parts
R45  100k  [FP-RC0805-0_6-IPC_C]
R46  100k  [FP-RC0805-0_6-IPC_C]
R47  100k  [FP-RC0805-0_6-IPC_C]
R48  100k  [FP-RC0805-0_6-IPC_C]
U7  LM4562NA  [N08E]  (part B of 2)

### Ports
DIFF (out, see TopLevel[3B]), IN_I (in, see TopLevel[3B], SummingAmplifier[2B]), IN_Q (in, see TopLevel[3B], SummingAmplifier[2B])

### Nets
+5: U7.8(V+)
-5: U7.4(V-)
GND: R45.1
NetR12_2: R47.2 ; port IN_I
NetR30_2: R46.1 ; port IN_Q
NetR45_2: R45.2 R46.2 U7.6(IN_B)
NetR47_1: R47.1 R48.1 U7.5(IN_B)
NetR48_2: R48.2 U7.7(OUT_B) ; port DIFF

### Notes on the sheet
- Power not connected as same chip as @{"Id":"JLXILWDS\FKZFFDXJ","ObjectType":2}

### Library data of the parts
R45-R48 = CMP-2100-03668-5: as R1 on sheet PhaseShiftNetwork; Package Quantity: 1; Case/Package: 0805; Lead Pitch: 0.4mm; Case Code (Imperial): 0805; Construction: Rectangular; Number of Terminations: 2; RoHS Compliant: Yes; Max Power Dissipation: 125mW; Tolerance: 1%; Max Operating Temperature: 155°C; Resistance Tolerance: 1%; Lead Free: Lead Free; Packaging: Tape and Reel; Resistor Type: Thick Film; Min Operating Temperature: -55°C; Case Code (Metric): 2012; Series: RC; Technology: THICK FILM; Voltage Rating: 150V; Termination: SMD/SMT; Width: 0.049inch; Number of Pins: 2; Features: Moisture Resistant; Military Standard: Not; Length: 0.079inch; Depth: 1.25mm; Size Code: 0805; Height: 0.024inch
U7 = CMP-0057-00043-2: as U7 on sheet SummingAmplifier; ComponentLink2Description: LM4562 Web Page; PinCount: 8; RoHS: Y; PackageReference: N08E; DatasheetVersion: Jan-2010; RevisionNote: Component URLs added; PackageVersion: revG, May-2006; Code_JEDEC: MS-001-BA; ComponentLink3URL: http://www.national.com/packaging/folders/n08e.html; ComponentLink1Description: LM4562 Datasheet; PackageDescription: MDIP, .365 x .250 x .130in, 8 Lead, .100in Pitch; ComponentLink3Description: N08E Package Page; ComponentLink1URL: http://www.national.com/ds/LM/LM4562.pdf; ComponentLink2URL: http://www.national.com/pf/LM/LM4562.html

## Sheet LowPassFilter.SchDoc
size A; SheetNumber: 7; SheetTotal: 7
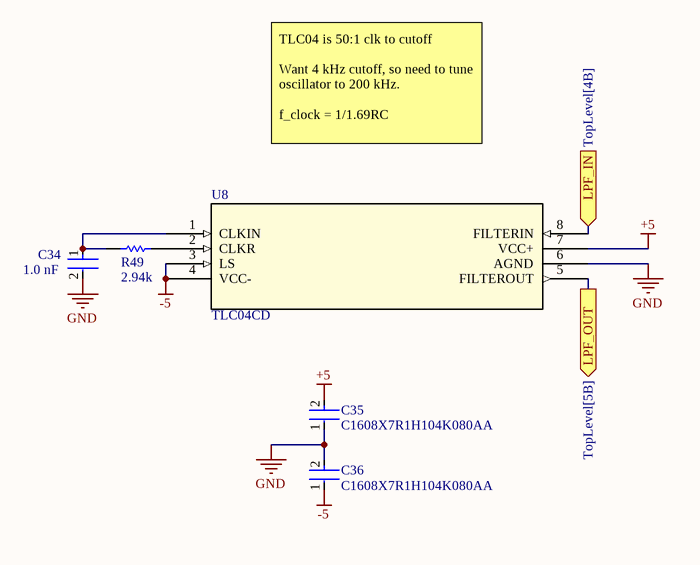
[diagram p6: LowPassFilter.SchDoc]

### Parts
C34  Capacitance: 1.0 nF  [FP-CC0603-DA-MFG]  (hidden comment: CC0603KRX7R9BB102)
C35  C1608X7R1H104K080AA  [FP-C1608-080-0_1-MFG]
C36  C1608X7R1H104K080AA  [FP-C1608-080-0_1-MFG]
R49  Resistance: 2.94k  [RESC1608X55X25ML10T15]  (hidden comment: RC0603FR-072K94L)
U8  TLC04CD  [D8]

### Ports
LPF_IN (in, see TopLevel[4B]), LPF_OUT (out, see TopLevel[5B])

### Nets
+5: C35.2 U8.7(VCC+)
-5: C36.1 U8.3(LS) U8.4(VCC-)
GND: C34.2 C35.1 C36.2 U8.6(AGND)
NetC14_1: U8.5(FILTEROUT) ; port LPF_OUT
NetC34_1: C34.1 R49.1 U8.1(CLKIN)
NetR49_2: R49.2 U8.2(CLKR)
NetSW1_2: U8.8(FILTERIN) ; port LPF_IN

### Notes on the sheet
- TLC04 is 50:1 clk to cutoff
  Want 4 kHz cutoff, so need to tune oscillator to 200 kHz.
  f_clock = 1/1.69RC

### Library data of the parts
C34 = CMP-2100-03599-2: CAP CER 1000PF 50V X7R 0603; Manufacturer: YAGEO; Material: Ceramic; Tolerance: 0.1; Description: CC0603 1.0 nF X7R 10.00% 50 V; Value: 1.0 nF; Temperature Coefficient: 15%; Device Class L3: Ceramic Capacitors; Automotive: No; Manufacturer Part Number: CC0603KRX7R9BB102; Digikey Description: CAP CER 1000PF 50V X7R 0603; Lead Free: Yes; Temperature Range High: +125°C; ComponentLink2URL: http://www.yageo.com/documents/recent/UPY-GPHC_X7R_6.3V-to-50V_18.pdf; Category: Cap; Footprint Url: http://www.yageo.com/exep/pages/download/literatures/UPY-C_GEN_24.pdf; RoHS: TRUE; Octopart: https://octopart.com/cc0603krx7r9bb102-yageo-192933; ComponentLink2Description: Datasheet; Device Class L2: Capacitors; Mouser Description: Multilayer Ceramic Capacitors MLCC - SMD/SMT 1.0nF 50V X7R 10%; Temperature Range Low: -55°C; Temperature Characteristic: X7R; Device Class L1: Passive Components; Temperature: -55°C to +125°C; Package: CC0603-DA; Voltage: 50 V; Voltage Rating: 50 V; Height: 0.9mm
C35 C36 = CMP-2000-04982-2: as C26 on sheet PhaseShiftNetwork; REACH SVHC: No SVHC; Voltage: 50V; Min Operating Temperature: -55°C; Package Quantity: 1; Case Code (Metric): 1608; Series: C; Termination: SMD/SMT; Length: 1.6mm; Voltage Rating: 50V; Case Code (Imperial): 0603; Number of Pins: 2; RoHS Compliant: Yes; Thickness: 0.037inch; Resistor Type: Ceramic; Radiation Hardening: No; Weight: 7.1E-05oz; Mount: Surface Mount; Capacitance: 100nF; Voltage Rating (DC): 50V; Construction: Flat; Tolerance: 10%; Lead Free: Lead Free; Case/Package: 0603; Max Operating Temperature: 125°C; Height: 0.8mm; Depth: 0.8mm; Packaging: Tape and Reel; Width: 0.031inch; Dielectric Material: Ceramic; Dielectric: X7R
R49 = CMP-1012-00561-2: Manufacturer: Yageo; Part Number: RC0603FR-072K94L
U8 = TLC04CD: No Description Available; Mfr_Name: Texas Instruments; RefDes: RefDes; Type: Type

## Nets that join several sheets
+5: TopLevel (J1.2 J4.1), PhaseShiftNetwork (6 pins), AudioAmp (5 pins), PowerRail (5 pins), SummingAmplifier (C32.2 U7.8), DifferenceAmplifier (U7.8), LowPassFilter (C35.2 U8.7)
-5: TopLevel (J4.2), PhaseShiftNetwork (6 pins), PowerRail (5 pins), SummingAmplifier (C33.1 U7.4), DifferenceAmplifier (U7.4), LowPassFilter (C36.1 U8.3 U8.4)
GND: TopLevel (8 pins), PhaseShiftNetwork (18 pins), AudioAmp (6 pins), PowerRail (15 pins), SummingAmplifier (C32.1 C33.2 R43.1), DifferenceAmplifier (R45.1), LowPassFilter (C34.2 C35.1 C36.2 U8.6)
AUDIO_L: TopLevel (J2.2 TP14.1), AudioAmp (R54.1 U4.14)
AUDIO_R: TopLevel (J2.1 TP16.1), AudioAmp (R55.1 U4.12)
NetC14_1: AudioAmp (C14.1 C16.1), LowPassFilter (U8.5)
NetR12_2: PhaseShiftNetwork (R12.2 U3.7), SummingAmplifier (R41.1), DifferenceAmplifier (R47.2)
NetR30_2: PhaseShiftNetwork (R30.2 U3.14), SummingAmplifier (R42.1), DifferenceAmplifier (R46.1)
NetR44_2: TopLevel (SW1.4 TP13.1), SummingAmplifier (R44.2 U7.1)
NetR48_2: TopLevel (SW1.1 TP17.1), DifferenceAmplifier (R48.2 U7.7)
NetSW1_2: TopLevel (SW1.2 TP18.1), LowPassFilter (U8.8)
RX_I: TopLevel (J1.1 J3.2), PhaseShiftNetwork (C1.1 R1.1)
RX_Q: TopLevel (J1.3 J3.3), PhaseShiftNetwork (C7.1 R19.1)